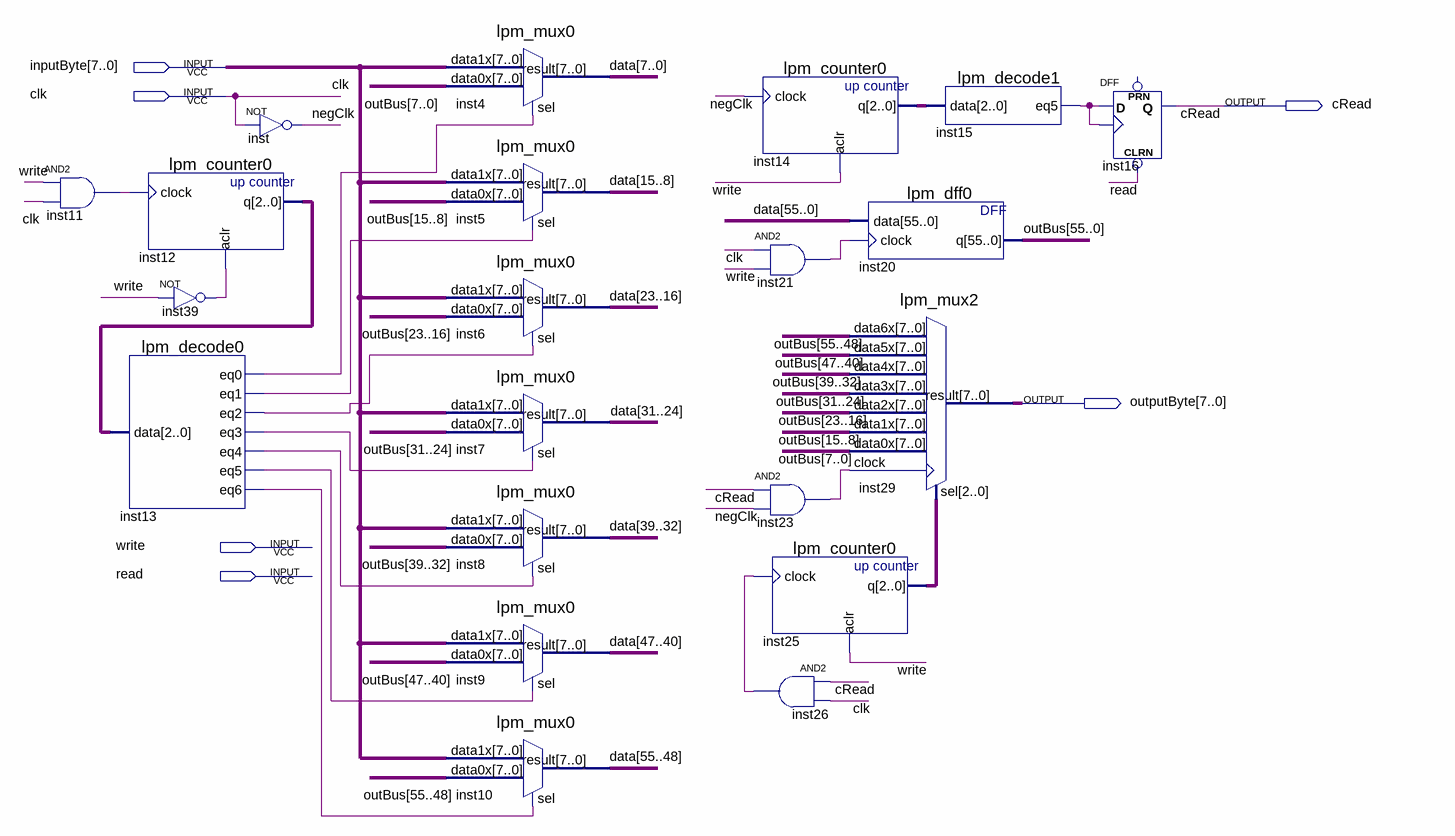
[diagram p0: schematic sheet]
// Quartus schematic Buffer.bdf as structural Verilog: 21 symbols, 6 pins
module Buffer (
  input  [7:0] inputByte,
  input  clk,
  input  write,
  input  read,
  output cRead,
  output [7:0] outputByte
);

  wire inst11_out, inst13_eq0, inst13_eq1, inst13_eq2, inst13_eq3, inst13_eq4, inst13_eq5, inst13_eq6,
       inst15_eq5, inst21_out, inst23_out, inst26_out, inst39_out, negClk;
  wire [2:0] inst12_q, inst14_q, inst25_q;
  wire [55:0] data, outBus;

  and inst11 (inst11_out, write, clk);
  lpm_counter0 inst12 (.clock(inst11_out), .aclr(inst39_out), .q(inst12_q));
  lpm_decode0 inst13 (
    .data(inst12_q), .eq0(inst13_eq0), .eq1(inst13_eq1), .eq2(inst13_eq2), .eq3(inst13_eq3),
    .eq4(inst13_eq4), .eq5(inst13_eq5), .eq6(inst13_eq6));
  not inst39 (inst39_out, write);
  not inst (negClk, clk);
  lpm_mux0 inst4 (.data1x(inputByte), .data0x(outBus[7:0]), .sel(inst13_eq0), .result(data[7:0]));
  lpm_mux0 inst5 (.data1x(inputByte), .data0x(outBus[15:8]), .sel(inst13_eq1), .result(data[15:8]));
  lpm_mux0 inst6 (.data1x(inputByte), .data0x(outBus[23:16]), .sel(inst13_eq2), .result(data[23:16]));
  lpm_mux0 inst7 (.data1x(inputByte), .data0x(outBus[31:24]), .sel(inst13_eq3), .result(data[31:24]));
  lpm_mux0 inst8 (.data1x(inputByte), .data0x(outBus[39:32]), .sel(inst13_eq4), .result(data[39:32]));
  lpm_mux0 inst9 (.data1x(inputByte), .data0x(outBus[47:40]), .sel(inst13_eq5), .result(data[47:40]));
  lpm_mux0 inst10 (.data1x(inputByte), .data0x(outBus[55:48]), .sel(inst13_eq6), .result(data[55:48]));
  lpm_counter0 inst14 (.clock(negClk), .aclr(write), .q(inst14_q));
  and inst21 (inst21_out, clk, write);
  and inst23 (inst23_out, cRead, negClk);
  lpm_counter0 inst25 (.clock(inst26_out), .aclr(write), .q(inst25_q));
  and inst26 (inst26_out, cRead, clk);
  lpm_dff0 inst20 (.data(data), .clock(inst21_out), .q(outBus));
  lpm_mux2 inst29 (
    .data6x(outBus[55:48]), .data5x(outBus[47:40]), .data4x(outBus[39:32]), .data3x(outBus[31:24]),
    .data2x(outBus[23:16]), .data1x(outBus[15:8]), .data0x(outBus[7:0]), .clock(inst23_out), .sel(inst25_q),
    .result(outputByte));
  lpm_decode1 inst15 (.data(inst14_q), .eq5(inst15_eq5));
  DFF inst16 (.CLRN(read), .CLK(inst15_eq5), .D(inst15_eq5), .Q(cRead));  // open: PRN
endmodule
